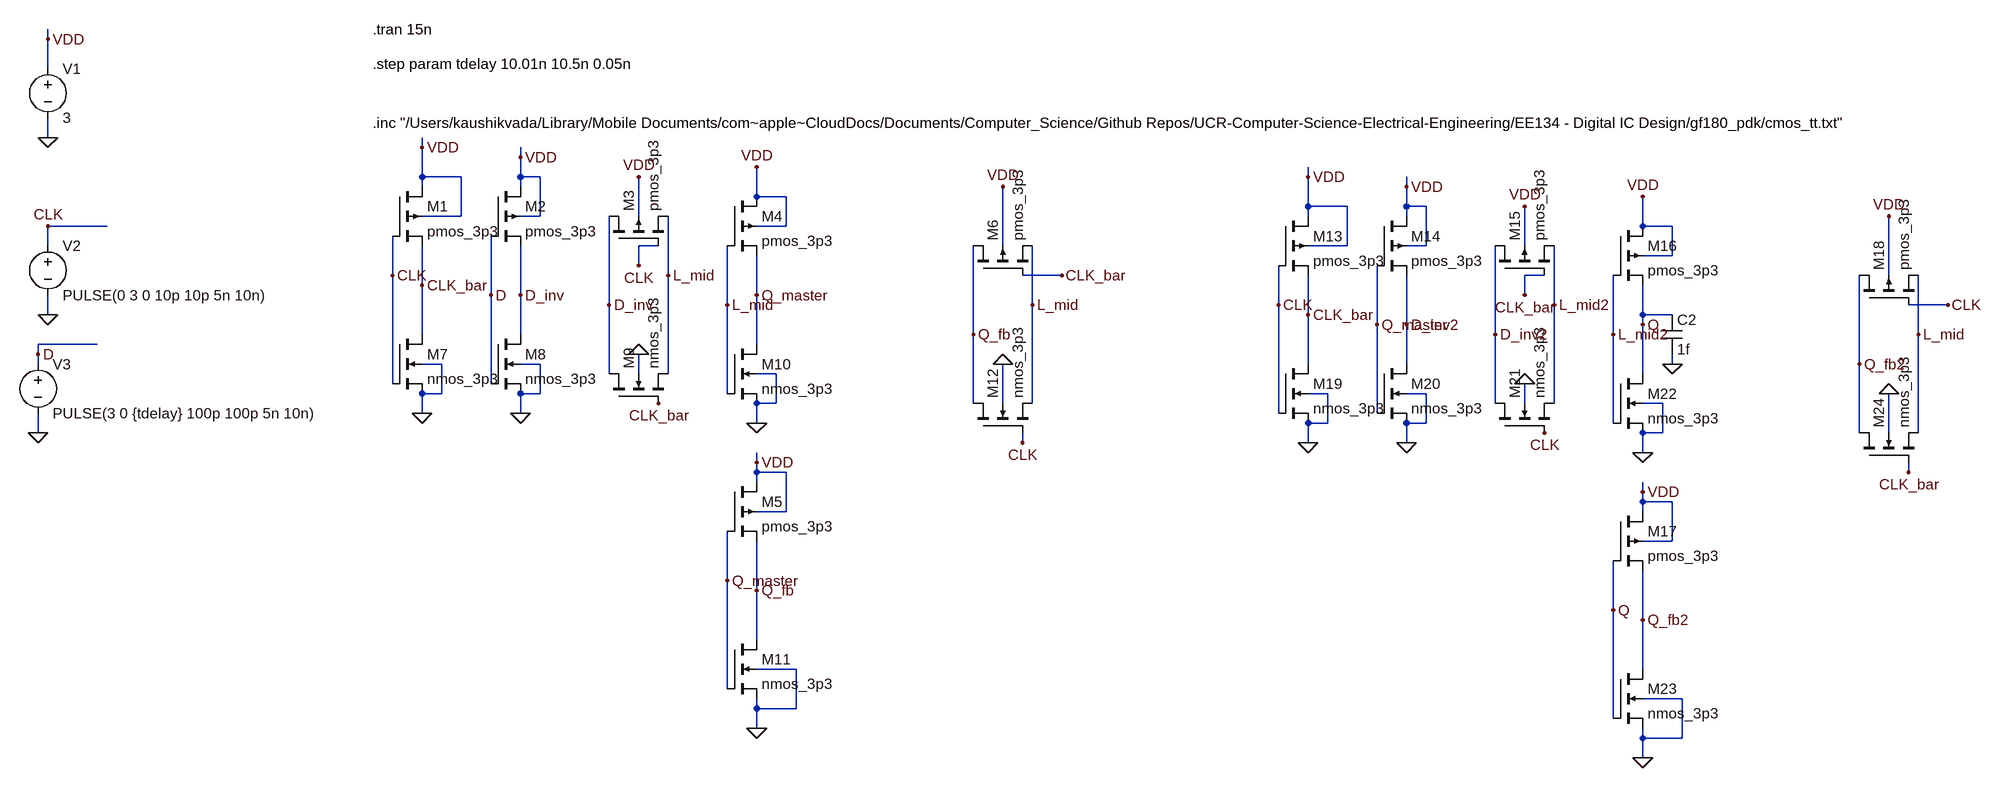
[diagram p0: schematic Q3_5.asc]
Q3_5.asc, the LTspice schematic file:
Version 4
SHEET 1 5316 1232
WIRE -768 -144 -768 -160
WIRE -768 -96 -768 -144
WIRE -768 16 -768 -16
WIRE -160 32 -160 16
WIRE 0 48 0 32
WIRE -160 80 -160 32
WIRE -96 80 -160 80
WIRE 0 80 0 48
WIRE 32 80 0 80
WIRE 1280 80 1280 64
WIRE -160 96 -160 80
WIRE 0 96 0 80
WIRE 1440 96 1440 80
WIRE 384 112 384 64
WIRE 432 112 384 112
WIRE 1280 128 1280 80
WIRE 1344 128 1280 128
WIRE 1440 128 1440 96
WIRE 1472 128 1440 128
WIRE -96 144 -96 80
WIRE -96 144 -160 144
WIRE 32 144 32 80
WIRE 32 144 0 144
WIRE 192 144 192 80
WIRE 1280 144 1280 128
WIRE 1440 144 1440 128
WIRE -672 160 -768 160
WIRE 432 160 432 112
WIRE 432 160 384 160
WIRE 1824 160 1824 112
WIRE 1872 160 1824 160
WIRE -768 192 -768 160
WIRE 224 192 192 192
WIRE 784 192 784 96
WIRE 1344 192 1344 128
WIRE 1344 192 1280 192
WIRE 1472 192 1472 128
WIRE 1472 192 1440 192
WIRE 1632 192 1632 128
WIRE 1872 208 1872 160
WIRE 1872 208 1824 208
WIRE 192 224 192 192
WIRE -208 240 -208 176
WIRE 240 240 240 144
WIRE 880 240 816 240
WIRE 1664 240 1632 240
WIRE 2224 240 2224 144
WIRE -160 256 -160 192
WIRE -48 272 -48 176
WIRE 0 272 0 192
WIRE 384 272 384 208
WIRE 1632 272 1632 240
WIRE 144 288 144 144
WIRE 336 288 336 192
WIRE 832 288 832 192
WIRE 1232 288 1232 224
WIRE 1680 288 1680 192
WIRE 2320 288 2256 288
WIRE -768 304 -768 272
WIRE 1280 304 1280 240
WIRE 1824 304 1824 256
WIRE 1872 304 1824 304
WIRE 1392 320 1392 224
WIRE 1440 320 1440 240
WIRE 1824 320 1824 304
WIRE -160 336 -160 256
WIRE 0 336 0 272
WIRE 736 336 736 192
WIRE 1584 336 1584 192
WIRE 1776 336 1776 240
WIRE 2272 336 2272 240
WIRE -688 352 -784 352
WIRE 384 352 384 272
WIRE -784 368 -784 352
WIRE -784 384 -784 368
WIRE -128 384 -160 384
WIRE 32 384 0 384
WIRE 1280 384 1280 304
WIRE 1440 384 1440 320
WIRE 1872 384 1872 368
WIRE 2176 384 2176 240
WIRE 144 400 144 288
WIRE 192 400 192 368
WIRE 240 400 240 240
WIRE 416 400 384 400
WIRE 1824 400 1824 320
WIRE -208 416 -208 240
WIRE -48 416 -48 272
WIRE -128 432 -128 384
WIRE -128 432 -160 432
WIRE 32 432 32 384
WIRE 32 432 0 432
WIRE 336 432 336 288
WIRE 1312 432 1280 432
WIRE 1472 432 1440 432
WIRE 416 448 416 400
WIRE 416 448 384 448
WIRE 736 448 736 336
WIRE 784 448 784 384
WIRE 832 448 832 288
WIRE 1584 448 1584 336
WIRE 1632 448 1632 416
WIRE 1680 448 1680 288
WIRE 1856 448 1824 448
WIRE -160 464 -160 432
WIRE 0 464 0 432
WIRE 1232 464 1232 288
WIRE 1392 464 1392 320
WIRE 384 480 384 448
WIRE 1312 480 1312 432
WIRE 1312 480 1280 480
WIRE 1472 480 1472 432
WIRE 1472 480 1440 480
WIRE 1776 480 1776 336
WIRE -784 496 -784 464
WIRE 1856 496 1856 448
WIRE 1856 496 1824 496
WIRE 2176 496 2176 384
WIRE 2224 496 2224 432
WIRE 2272 496 2272 336
WIRE 816 512 816 496
WIRE 1280 512 1280 480
WIRE 1440 512 1440 480
WIRE 1824 528 1824 496
WIRE 384 544 384 528
WIRE 384 560 384 544
WIRE 432 560 384 560
WIRE 2256 560 2256 544
WIRE 384 576 384 560
WIRE 1824 592 1824 576
WIRE 1824 608 1824 592
WIRE 1872 608 1824 608
WIRE 432 624 432 560
WIRE 432 624 384 624
WIRE 1824 624 1824 608
WIRE 1872 672 1872 608
WIRE 1872 672 1824 672
WIRE 336 736 336 656
WIRE 384 752 384 672
WIRE 1776 784 1776 704
WIRE 1824 800 1824 720
WIRE 384 832 384 752
WIRE 448 880 384 880
WIRE 1824 880 1824 800
WIRE 336 912 336 736
WIRE 1888 928 1824 928
WIRE 384 944 384 928
WIRE 448 944 448 880
WIRE 448 944 384 944
WIRE 1776 960 1776 784
WIRE 384 976 384 944
WIRE 1824 992 1824 976
WIRE 1888 992 1888 928
WIRE 1888 992 1824 992
WIRE 1824 1024 1824 992
FLAG -768 16 0
FLAG -768 304 0
FLAG -784 496 0
FLAG -768 160 CLK
FLAG -784 368 D
FLAG -160 464 0
FLAG -160 256 CLK_bar
FLAG -208 240 CLK
FLAG -160 32 VDD
FLAG 0 48 VDD
FLAG 0 464 0
FLAG 0 272 D_inv
FLAG -48 272 D
FLAG 144 288 D_inv
FLAG 240 240 L_mid
FLAG 192 80 VDD
FLAG 192 224 CLK
FLAG 224 448 CLK_bar
FLAG 192 368 0
FLAG 384 64 VDD
FLAG 384 480 0
FLAG 336 288 L_mid
FLAG 384 272 Q_master
FLAG 384 544 VDD
FLAG 384 976 0
FLAG 336 736 Q_master
FLAG 384 752 Q_fb
FLAG 736 336 Q_fb
FLAG 832 288 L_mid
FLAG 784 96 VDD
FLAG 784 384 0
FLAG 880 240 CLK_bar
FLAG 816 512 CLK
FLAG 1280 512 0
FLAG 1280 304 CLK_bar
FLAG 1232 288 CLK
FLAG 1280 80 VDD
FLAG 1440 96 VDD
FLAG 1440 512 0
FLAG 1440 320 D_inv2
FLAG 1392 320 Q_master
FLAG 1584 336 D_inv2
FLAG 1680 288 L_mid2
FLAG 1632 128 VDD
FLAG 1632 272 CLK_bar
FLAG 1664 496 CLK
FLAG 1632 416 0
FLAG 1824 112 VDD
FLAG 1824 528 0
FLAG 1776 336 L_mid2
FLAG 1824 320 Q
FLAG 1872 384 0
FLAG 1824 592 VDD
FLAG 1824 1024 0
FLAG 1776 784 Q
FLAG 1824 800 Q_fb2
FLAG 2176 384 Q_fb2
FLAG 2272 336 L_mid
FLAG 2224 144 VDD
FLAG 2224 432 0
FLAG 2320 288 CLK
FLAG 2256 560 CLK_bar
FLAG -768 -144 VDD
SYMBOL pmos4 -208 96 R0
SYMATTR InstName M1
SYMATTR Value pmos_3p3
SYMATTR Value2 l=1u w=4u
SYMBOL pmos4 -48 96 R0
SYMATTR InstName M2
SYMATTR Value pmos_3p3
SYMATTR Value2 l=1u w=4u
SYMBOL pmos4 144 192 R270
SYMATTR InstName M3
SYMATTR Value pmos_3p3
SYMATTR Value2 l=1u w=4u
SYMBOL pmos4 336 112 R0
SYMATTR InstName M4
SYMATTR Value pmos_3p3
SYMATTR Value2 l=1u w=4u
SYMBOL pmos4 336 576 R0
SYMATTR InstName M5
SYMATTR Value pmos_3p3
SYMATTR Value2 l=1u w=4u
SYMBOL pmos4 736 240 R270
SYMATTR InstName M6
SYMATTR Value pmos_3p3
SYMATTR Value2 l=1u w=4u
SYMBOL nmos4 -208 336 R0
SYMATTR InstName M7
SYMATTR Value nmos_3p3
SYMATTR Value2 l=1u w=2u
SYMBOL nmos4 -48 336 R0
SYMATTR InstName M8
SYMATTR Value nmos_3p3
SYMATTR Value2 l=1u w=2u
SYMBOL nmos4 144 448 R270
SYMATTR InstName M9
SYMATTR Value nmos_3p3
SYMATTR Value2 l=1u w=2u
SYMBOL nmos4 336 352 R0
SYMATTR InstName M10
SYMATTR Value nmos_3p3
SYMATTR Value2 l=1u w=2u
SYMBOL nmos4 336 832 R0
SYMATTR InstName M11
SYMATTR Value nmos_3p3
SYMATTR Value2 l=1u w=2u
SYMBOL nmos4 736 496 R270
SYMATTR InstName M12
SYMATTR Value nmos_3p3
SYMATTR Value2 l=1u w=2u
SYMBOL voltage -768 -112 R0
SYMATTR InstName V1
SYMATTR Value 3
SYMBOL voltage -768 176 R0
SYMATTR InstName V2
SYMATTR Value PULSE(0 3 0 10p 10p 5n 10n)
SYMBOL voltage -784 368 R0
SYMATTR InstName V3
SYMATTR Value PULSE(3 0 {tdelay} 100p 100p 5n 10n)
SYMBOL pmos4 1232 144 R0
SYMATTR InstName M13
SYMATTR Value pmos_3p3
SYMATTR Value2 l=1u w=4u
SYMBOL pmos4 1392 144 R0
SYMATTR InstName M14
SYMATTR Value pmos_3p3
SYMATTR Value2 l=1u w=4u
SYMBOL pmos4 1584 240 R270
SYMATTR InstName M15
SYMATTR Value pmos_3p3
SYMATTR Value2 l=1u w=4u
SYMBOL pmos4 1776 160 R0
SYMATTR InstName M16
SYMATTR Value pmos_3p3
SYMATTR Value2 l=1u w=4u
SYMBOL pmos4 1776 624 R0
SYMATTR InstName M17
SYMATTR Value pmos_3p3
SYMATTR Value2 l=1u w=4u
SYMBOL pmos4 2176 288 R270
SYMATTR InstName M18
SYMATTR Value pmos_3p3
SYMATTR Value2 l=1u w=4u
SYMBOL nmos4 1232 384 R0
SYMATTR InstName M19
SYMATTR Value nmos_3p3
SYMATTR Value2 l=1u w=2u
SYMBOL nmos4 1392 384 R0
SYMATTR InstName M20
SYMATTR Value nmos_3p3
SYMATTR Value2 l=1u w=2u
SYMBOL nmos4 1584 496 R270
SYMATTR InstName M21
SYMATTR Value nmos_3p3
SYMATTR Value2 l=1u w=2u
SYMBOL nmos4 1776 400 R0
SYMATTR InstName M22
SYMATTR Value nmos_3p3
SYMATTR Value2 l=1u w=2u
SYMBOL nmos4 1776 880 R0
SYMATTR InstName M23
SYMATTR Value nmos_3p3
SYMATTR Value2 l=1u w=2u
SYMBOL nmos4 2176 544 R270
SYMATTR InstName M24
SYMATTR Value nmos_3p3
SYMATTR Value2 l=1u w=2u
SYMBOL cap 1856 304 R0
SYMATTR InstName C2
SYMATTR Value 1f
TEXT -240 -8 Left 2 !.inc "/Users/kaushikvada/Library/Mobile Documents/com~apple~CloudDocs/Documents/Computer_Science/Github Repos/UCR-Computer-Science-Electrical-Engineering/EE134 - Digital IC Design/gf180_pdk/cmos_tt.txt"
TEXT -240 -160 Left 2 !.tran 15n
TEXT -240 -104 Left 2 !.step param tdelay 10.01n 10.5n 0.05n

The netlist it stands for:
* Q3_5.asc
M1 VDD CLK CLK_bar VDD pmos_3p3 l=1u w=4u
M2 VDD D D_inv VDD pmos_3p3 l=1u w=4u
M3 D_inv CLK L_mid VDD pmos_3p3 l=1u w=4u
M4 VDD L_mid Q_master VDD pmos_3p3 l=1u w=4u
M5 VDD Q_master Q_fb VDD pmos_3p3 l=1u w=4u
M6 Q_fb CLK_bar L_mid VDD pmos_3p3 l=1u w=4u
M7 CLK_bar CLK 0 0 nmos_3p3 l=1u w=2u
M8 D_inv D 0 0 nmos_3p3 l=1u w=2u
M9 D_inv CLK_bar L_mid 0 nmos_3p3 l=1u w=2u
M10 Q_master L_mid 0 0 nmos_3p3 l=1u w=2u
M11 Q_fb Q_master 0 0 nmos_3p3 l=1u w=2u
M12 Q_fb CLK L_mid 0 nmos_3p3 l=1u w=2u
V1 VDD 0 3
V2 CLK 0 PULSE(0 3 0 10p 10p 5n 10n)
V3 D 0 PULSE(3 0 {tdelay} 100p 100p 5n 10n)
M13 VDD CLK CLK_bar VDD pmos_3p3 l=1u w=4u
M14 VDD Q_master D_inv2 VDD pmos_3p3 l=1u w=4u
M15 D_inv2 CLK_bar L_mid2 VDD pmos_3p3 l=1u w=4u
M16 VDD L_mid2 Q VDD pmos_3p3 l=1u w=4u
M17 VDD Q Q_fb2 VDD pmos_3p3 l=1u w=4u
M18 Q_fb2 CLK L_mid VDD pmos_3p3 l=1u w=4u
M19 CLK_bar CLK 0 0 nmos_3p3 l=1u w=2u
M20 D_inv2 Q_master 0 0 nmos_3p3 l=1u w=2u
M21 D_inv2 CLK L_mid2 0 nmos_3p3 l=1u w=2u
M22 Q L_mid2 0 0 nmos_3p3 l=1u w=2u
M23 Q_fb2 Q 0 0 nmos_3p3 l=1u w=2u
M24 Q_fb2 CLK_bar L_mid 0 nmos_3p3 l=1u w=2u
C2 Q 0 1f
.model NMOS NMOS
.model PMOS PMOS
.lib standard.mos
.inc "/Users/kaushikvada/Library/Mobile Documents/com~apple~CloudDocs/Documents/Computer_Science/Github Repos/UCR-Computer-Science-Electrical-Engineering/EE134 - Digital IC Design/gf180_pdk/cmos_tt.txt"
.tran 15n
.step param tdelay 10.01n 10.5n 0.05n
.backanno
.end